# Altium project IMX8SoCIot.PrjPcb (part 6 of 9)

## Sheet USB_HUB.SchDoc
size 594 x 420 mm; SheetNumber: 14; SheetTotal: 20
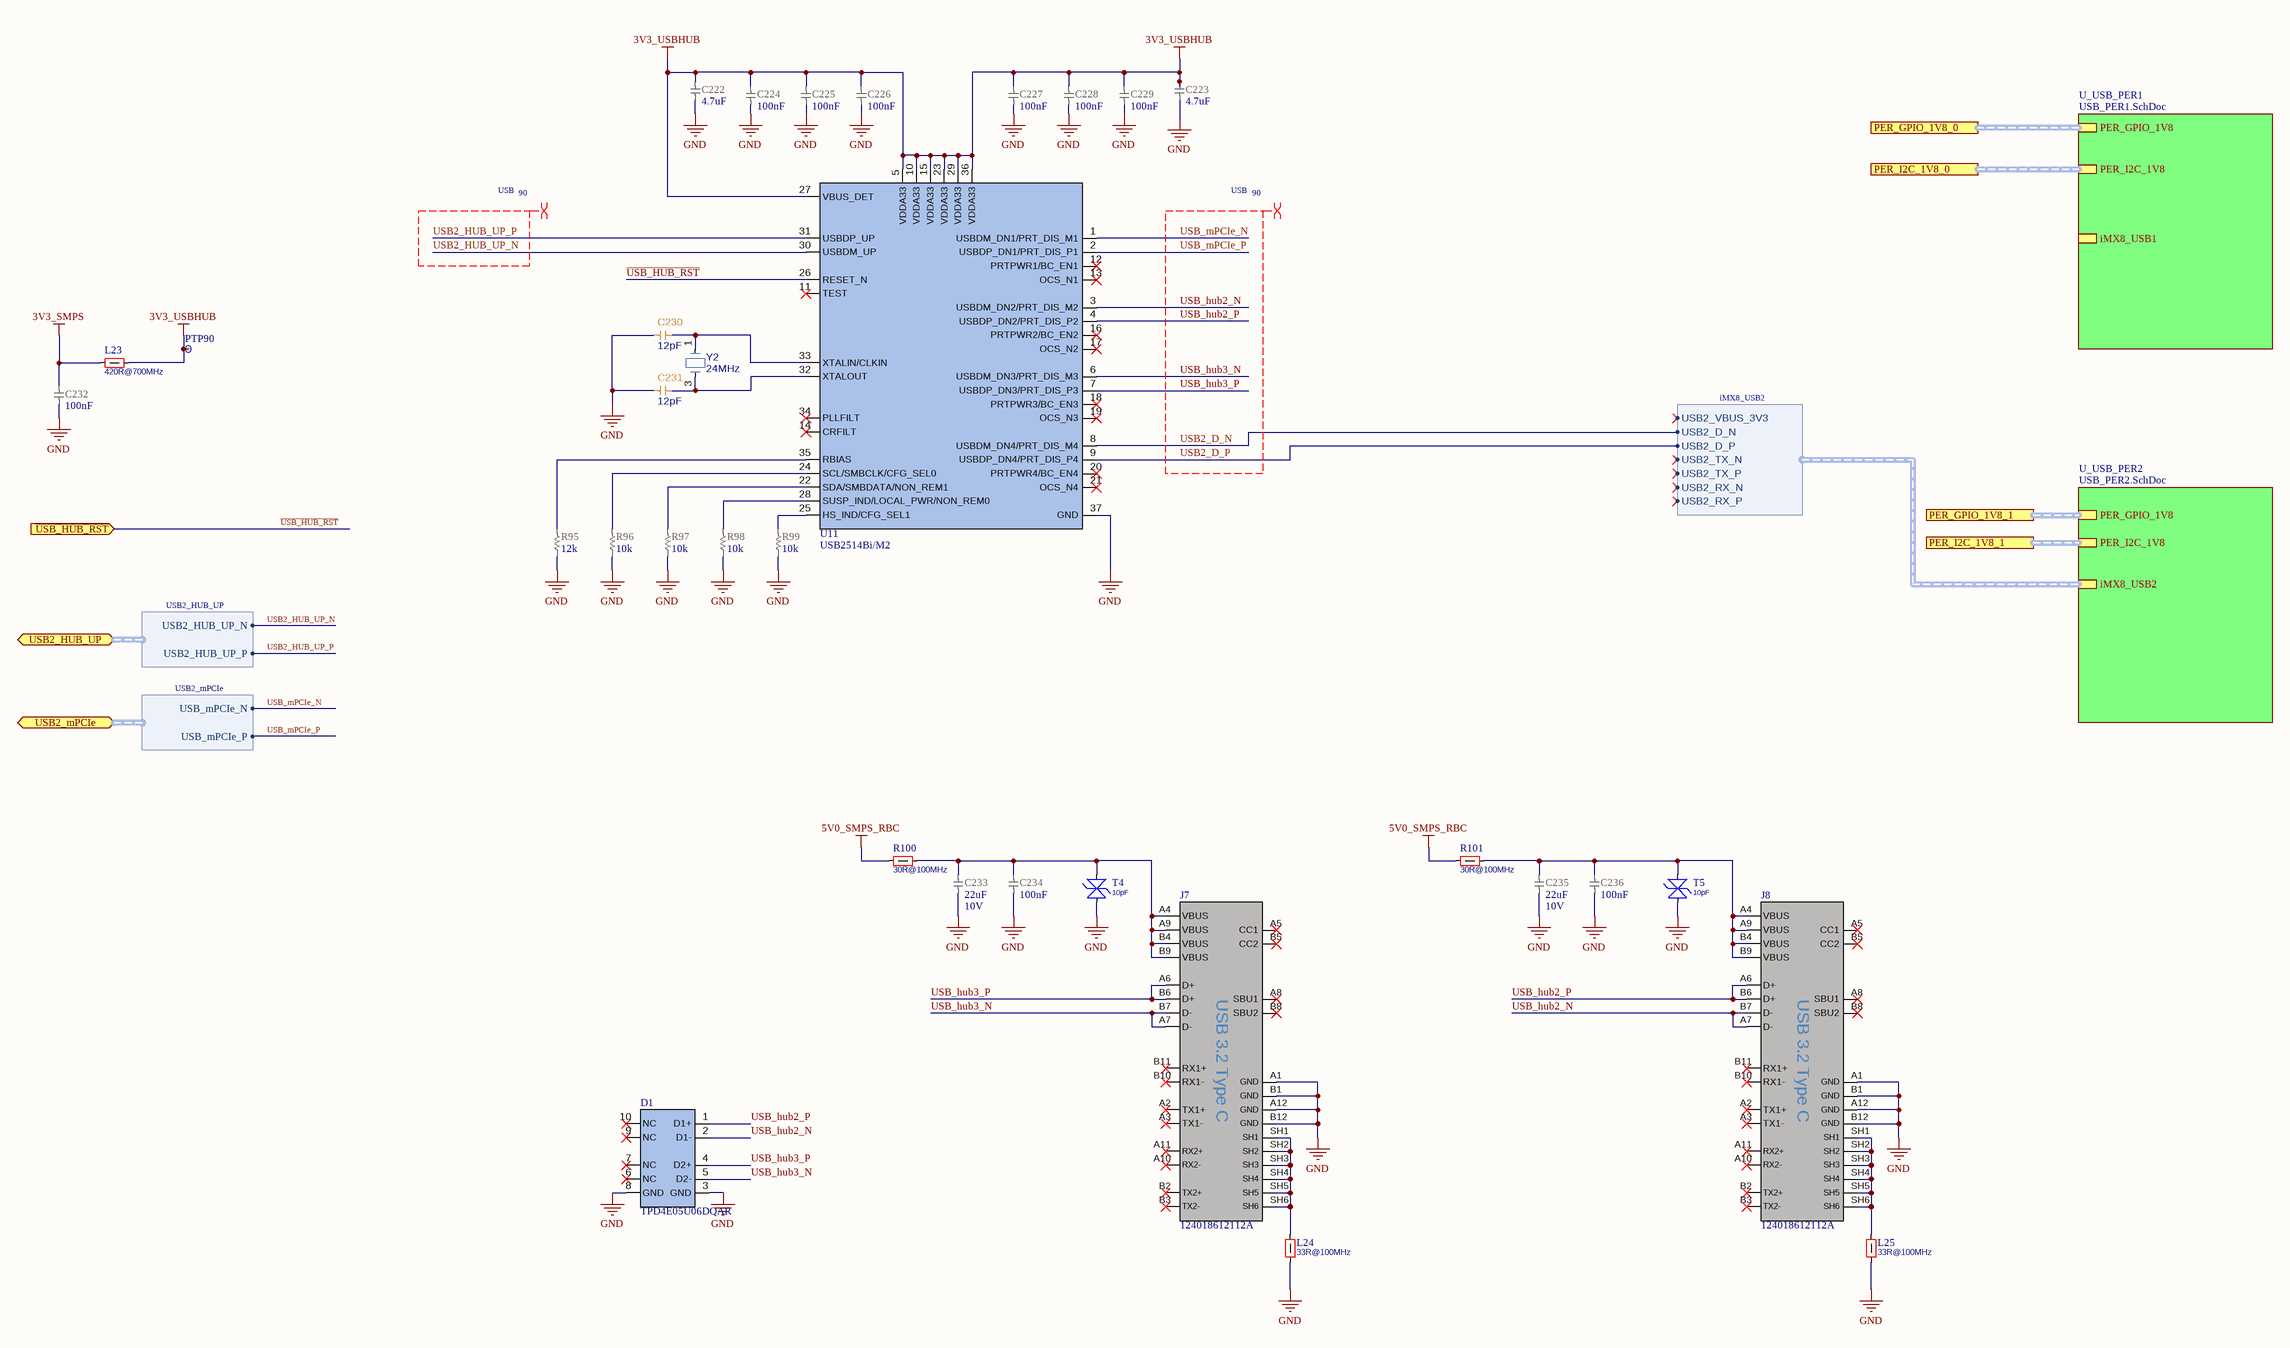
[diagram p25: USB_HUB.SchDoc]

### Parts
(Parts that share a designator on the sheet are numbered #1, #2 ... from top to bottom, then left to right.)
C222  value 4.7uF  [CAP_0402_H09W07_UN1Q]  (hidden comment: CAP_0402_4u7_10V_X6S)
C223  value 4.7uF  [CAP_0402_H09W07_UN1Q]  (hidden comment: CAP_0402_4u7_10V_X6S)
C224  value 100nF  [CAP_0201_UN1Q]  (hidden comment: CAP_0201_100n_X7S_16V)
C225  value 100nF  [CAP_0201_UN1Q]  (hidden comment: CAP_0201_100n_X7S_16V)
C226  value 100nF  [CAP_0201_UN1Q]  (hidden comment: CAP_0201_100n_X7S_16V)
C227  value 100nF  [CAP_0201_UN1Q]  (hidden comment: CAP_0201_100n_X7S_16V)
C228  value 100nF  [CAP_0201_UN1Q]  (hidden comment: CAP_0201_100n_X7S_16V)
C229  value 100nF  [CAP_0201_UN1Q]  (hidden comment: CAP_0201_100n_X7S_16V)
C230  value 12pF  [CAP_0201_UN1Q]  (hidden comment: CAP_0201_12pF_RF_MATCHING)
C231  value 12pF  [CAP_0201_UN1Q]  (hidden comment: CAP_0201_12pF_RF_MATCHING)
C232  value 100nF  [CAP_0201_UN1Q]  (hidden comment: CAP_0201_100n_X7S_16V)
C233  value 22uF  Voltage: 10V  [CAP_0805_UN1Q]  (hidden comment: CAP_0805_22uF_10V_X7R)
C234  value 100nF  [CAP_0201_UN1Q]  (hidden comment: CAP_0201_100n_X7S_16V)
C235  value 22uF  Voltage: 10V  [CAP_0805_UN1Q]  (hidden comment: CAP_0805_22uF_10V_X7R)
C236  value 100nF  [CAP_0201_UN1Q]  (hidden comment: CAP_0201_100n_X7S_16V)
D1  TPD4E05U06DQAR  [USON10_DQA_TI]
J7  Part Number: 124018612112A  [USB_C_AMPHENOL_124018612112A]  (hidden comment: USB_C_AMPHENOL_124018612112A)
J8  Part Number: 124018612112A  [USB_C_AMPHENOL_124018612112A]  (hidden comment: USB_C_AMPHENOL_124018612112A)
L23  value 420R@700MHz  [IND_0201_UN1Q]  (hidden comment: FERRITE_0201_BLF_700MHz_420Ohm)
L24  value 33R@100MHz  [IND_0201_UN1Q]  (hidden comment: FERRITE_0201_BLM03_33Ohm)
L25  value 33R@100MHz  [IND_0201_UN1Q]  (hidden comment: FERRITE_0201_BLM03_33Ohm)
PTP90  PTP_0.4mm  [PTP_0.4mm]  (value not drawn)  (no BOM)
R95  value 12k  [RES_0201_UN1Q]  (hidden comment: RES_0201_12k)
R96  value 10k  [RES_0201_UN1Q]  (hidden comment: RES_0201_10k)
R97  value 10k  [RES_0201_UN1Q]  (hidden comment: RES_0201_10k)
R98  value 10k  [RES_0201_UN1Q]  (hidden comment: RES_0201_10k)
R99  value 10k  [RES_0201_UN1Q]  (hidden comment: RES_0201_10k)
R100  value 30R@100MHz  [FERR_BLM15KD]  (hidden comment: FERRITE_0402_BLM15KD)
R101  value 30R@100MHz  [FERR_BLM15KD]  (hidden comment: FERRITE_0402_BLM15KD)
T4  value 10pF  [TVS_0201_EZAEG]  (hidden comment: TVS_0201_10pF)
T5  value 10pF  [TVS_0201_EZAEG]  (hidden comment: TVS_0201_10pF)
U11#2  Part Number: USB2514Bi/M2  [USB251xB_QFN36P50_600X600X100]  (hidden comment: USB2514Bi_M2)
Y2  value 24MHz  [XTAL_3225_EPSON]  (hidden comment: XTAL_24M_10ppm_9pF_+105C)

### Sub-sheets
U_USB_PER1 = USB_PER1.SchDoc: PER_GPIO_1V8 (harness PER_GPIO_1V8_0), iMX8_USB1 (harness iMX8_USB1), PER_I2C_1V8 (harness PER_I2C_1V8_0)
U_USB_PER2 = USB_PER2.SchDoc: PER_GPIO_1V8 (harness PER_GPIO_1V8_1), PER_I2C_1V8 (harness PER_I2C_1V8_1), iMX8_USB2 (harness iMX8_USB2)

### Ports
PER_GPIO_1V8_0 (harness PER_GPIO_1V8_0), PER_GPIO_1V8_1 (harness PER_GPIO_1V8_1), PER_I2C_1V8_0 (harness PER_GPIO_1V8_0), PER_I2C_1V8_1 (harness PER_GPIO_1V8_1), USB2_HUB_UP (bidir, harness USB2_HUB_UP), USB2_mPCIe (bidir, harness USB2_mPCIe), ~{USB_HUB_RST} (in)

### Harnesses
USB2_HUB_UP: USB2_HUB_UP_P, USB2_HUB_UP_N
USB2_mPCIe: USB_mPCIe_N, USB_mPCIe_P
iMX8_USB2: USB2_VBUS_3V3, USB2_D_N, USB2_D_P, USB2_TX_N, USB2_TX_P, USB2_RX_N, USB2_RX_P

### Nets
3V3_SMPS: C232.2 L23.1
3V3_USBHUB: C222.2 C223.2 C224.1 C225.1 C226.1 C227.1 C228.1 C229.1 L23.2 PTP90.1(TP) U11#2.5(VDDA33) U11#2.10(VDDA33) U11#2.15(VDDA33) U11#2.23(VDDA33) U11#2.27(VBUS_DET) U11#2.29(VDDA33) U11#2.36(VDDA33)
5V0_SMPS_RBC: R100.1 R101.1
GND: C222.1 C223.1 C224.2 C225.2 C226.2 C227.2 C228.2 C229.2 C230.1 C231.1 C232.1 C233.1 C234.1 C235.1 C236.1 D1.3(GND) D1.8(GND) J7.A1(GND) J7.A12(GND) J7.B1(GND) J7.B12(GND) J8.A1(GND) J8.A12(GND) J8.B1(GND) J8.B12(GND) L24.2 L25.2 R95.1 R96.1 R97.1 R98.1 R99.1 T4.1 T5.1 U11#2.37(GND) Y2.2(GND) Y2.4(GND)
~{USB_HUB_RST}: U11#2.26(RESET_N) ; port ~{USB_HUB_RST}
USB2_D_N: U11#2.8(USBDM_DN4/PRT_DIS_M4) ; sheet U_USB_PER2/iMX8_USB2.USB2_D_N
USB2_D_P: U11#2.9(USBDP_DN4/PRT_DIS_P4) ; sheet U_USB_PER2/iMX8_USB2.USB2_D_P
USB2_HUB_UP_N: U11#2.30(USBDM_UP) ; port USB2_HUB_UP.USB2_HUB_UP_N
USB2_HUB_UP_P: U11#2.31(USBDP_UP) ; port USB2_HUB_UP.USB2_HUB_UP_P
USB_hub2_N: D1.2(D1-) J8.A7(D-) J8.B7(D-) U11#2.3(USBDM_DN2/PRT_DIS_M2)
USB_hub2_P: D1.1(D1+) J8.A6(D+) J8.B6(D+) U11#2.4(USBDP_DN2/PRT_DIS_P2)
USB_hub3_N: D1.5(D2-) J7.A7(D-) J7.B7(D-) U11#2.6(USBDM_DN3/PRT_DIS_M3)
USB_hub3_P: D1.4(D2+) J7.A6(D+) J7.B6(D+) U11#2.7(USBDP_DN3/PRT_DIS_P3)
USB_mPCIe_N: U11#2.1(USBDM_DN1/PRT_DIS_M1) ; port USB2_mPCIe.USB_mPCIe_N
USB_mPCIe_P: U11#2.2(USBDP_DN1/PRT_DIS_P1) ; port USB2_mPCIe.USB_mPCIe_P
NetC230_2: C230.2 U11#2.33(XTALIN/CLKIN) Y2.1
NetC231_2: C231.2 U11#2.32(XTALOUT) Y2.3
NetC233_2: C233.2 C234.2 J7.A4(VBUS) J7.A9(VBUS) J7.B4(VBUS) J7.B9(VBUS) R100.2 T4.2
NetC235_2: C235.2 C236.2 J8.A4(VBUS) J8.A9(VBUS) J8.B4(VBUS) J8.B9(VBUS) R101.2 T5.2
NetJ7_SH1: J7.SH1 J7.SH2 J7.SH3 J7.SH4 J7.SH5 J7.SH6 L24.1
NetJ8_SH1: J8.SH1 J8.SH2 J8.SH3 J8.SH4 J8.SH5 J8.SH6 L25.1
NetR95_2: R95.2 U11#2.35(RBIAS)
NetR96_2: R96.2 U11#2.24(SCL/SMBCLK/CFG_SEL0)
NetR97_2: R97.2 U11#2.22(SDA/SMBDATA/NON_REM1)
NetR98_2: R98.2 U11#2.28(SUSP_IND/LOCAL_PWR/NON_REM0)
NetR99_2: R99.2 U11#2.25(HS_IND/CFG_SEL1)

Not connected (* = marked no-connect by the designer): D1 6(NC)* 7(NC)* 9(NC)* 10(NC)*; J7 A2(TX1+)* A3(TX1-)* A5(CC1)* A8(SBU1)* A10(RX2-)* A11(RX2+)* B2(TX2+)* B3(TX2-)* B5(CC2)* B8(SBU2)* B10(RX1-)* B11(RX1+)*; J8 A2(TX1+)* A3(TX1-)* A5(CC1)* A8(SBU1)* A10(RX2-)* A11(RX2+)* B2(TX2+)* B3(TX2-)* B5(CC2)* B8(SBU2)* B10(RX1-)* B11(RX1+)*; U11#2 11(TEST)* 12(PRTPWR1/BC_EN1)* 13(OCS_N1)* 14(CRFILT)* 16(PRTPWR2/BC_EN2)* 17(OCS_N2)* 18(PRTPWR3/BC_EN3)* 19(OCS_N3)* 20(PRTPWR4/BC_EN4)* 21(OCS_N4)* 34(PLLFILT)*

### Buses and harness runs
harness port PER_GPIO_1V8_0 = sheet U_USB_PER1/PER_GPIO_1V8
harness port PER_GPIO_1V8_1 = sheet U_USB_PER2/PER_GPIO_1V8
harness port PER_I2C_1V8_0 = sheet U_USB_PER1/PER_I2C_1V8
harness port PER_I2C_1V8_1 = sheet U_USB_PER2/PER_I2C_1V8

### Layout directives
differential pair; differential pair class 90; net class USB; rule Matched Net Lengths [Tolerance = 0.3mm]: USB2_D_N, USB2_D_P, USB2_HUB_UP_N, USB2_HUB_UP_P, USB_hub2_N, USB_hub2_P, USB_hub3_N, USB_hub3_P, USB_mPCIe_N, USB_mPCIe_P

### Notes on the sheet
- DWG NO:
- REV:
- THIS DOCUMENT AND THE DATA DISCLOSED HEREIN OR
- HEREWITH IS THE PROPERTY OF ALTIUM LIMITED AND MAY
- BE FREELY DISTRIBUTED IN WHOLE. NO RIGHTS ARE
- RESERVED OR EXPRESS OR IMPLIED WARANTEE GIVEN.
- REVISION
- DESCRIPTION
- DATE
- APPROVED
- ENG:
- APPROVALS
- PROJECT
- DSN:
- CHK:
- REFERENCE DOCUMENTS
- PROJECT REVISION:
- TITLE
- DOCUMENT REVISION:
- DESIGN ITEM:
- BOM:
- FAB DWG:
- PCB DWG:
- ASSY DWG:
- SCALE:
- A2
- SIZE
- CAGE CODE
- FILE NAME
- DWG NO.
- SHEET
- OF
- REV
- (in symbol CMP-001-001438-8) USB 3.2 Type C

### Library data of the parts
C222 C223 = CMP-001-000888-12: as C121 on sheet IMX8_PMIC; ComponentLink2Description: 2_Product page; Package: 0402; Creation date: 26042024; ComponentLink1Description: 1_Datasheet; ComponentLink3Description: 3_X-information; ComponentLink4Description: 4_X-information; Manufacturer Part Number: GRT155C81A475ME13J; Component Type: Capacitor
C224-C229 C232 C234 C236 = CMP-001-000385-16: CAP; Part Number: GRM033C71C104KE14D; Manufacturer: Murata; Temperature characteristics: X7S; Tolerance: +/-10%; Sort order: 302; HasBeenBuilt: TBD; Alternative component: Allowed; Voltage: 16V; System: RLC; Package: 0201; ClassName: SMALL; ComponentLink1Description: 1_Datasheet; ComponentLink2Description: 2_Product page; ComponentLink3Description: 3_X-information; ComponentLink4Description: 4_X-information; Creation date: 20190101; Source: RLC_UN1Q.SchLib; Manufacturer Part Number: GRM033C71C104KE14D; Component Type: Capacitor
C230 C231 = CMP-001-000420-11: as C139 on sheet IMX8_PMIC; Package: 0201; Operating temperature range: -55 ... +125C; ComponentLink1Description: 1_Datasheet; ComponentLink2Description: 2_Product page; ComponentLink3Description: 3_X-information; ComponentLink4Description: 4_X-information; Creation date: 20211123; ClassName: SMALL; Source: RLC_UN1Q.SchLib; Manufacturer Part Number: GRM0335C1H120GA01; Component Type: Capacitor
C233 C235 = CMP-001-000892-11: CAP; Part Number: GRM21BZ71A226ME15L; Manufacturer: Murata; Tolerance: +/-20%; Alternative component: Allowed; Sort order: 308; Temperature characteristics: X7R; System: RLC; HasBeenBuilt: TBD; Creation date: 22032024; ComponentLink4Description: 4_X-information; ComponentLink1Description: 1_Datasheet; ComponentLink3Description: 3_X-information; ComponentLink2Description: 2_Product page; Package: 0805; Manufacturer Part Number: GRM21BZ71A226ME15L; Component Type: Capacitor
D1 = CMP-001-000916-4: 4-CH Low-Capacitance ESD Diode; Manufacturer: Texas Instruments; HasBeenBuilt: Saluki3_HW_RIB_2; Sort order: 405; System: IC; ComponentLink1Description: 1_Datasheet; ComponentLink1URL: http://www.ti.com/lit/gpn/tpd4e05u06; ComponentLink2Description: 2_Product page; ComponentLink2URL: https://www.ti.com/product/TPD4E05U06; ComponentLink3Description: 3_X-information; ComponentLink4Description: 4_X-information; Creation date: 20210927; Dimensions WxLxH: 2.5x1.0x0.55; Operating temperature range: -40... +125 °C; Package: USON10; Part Number: TPD4E05U06DQAR; ECCN: EAR99; RoHS: RoHS3; Source: UUDET_KOMPONENTIT.SchLib; Manufacturer Part Number: TPD4E05U06DQAR; Component Type: ESD & EMI
J7 J8 = CMP-001-001438-8: USB3.2 GEN1, Type C, Top mount, CH 1.50mm, Dual Row SMT, IPX8; Manufacturer Part Number: 12402082E512A; Sort order: 101; System: Connector; ClassName: BIG; ComponentLink1Description: 1_Datasheet; ComponentLink1URL: https://cdn.amphenol-cs.com/media/wysiwyg/files/documentation/datasheet/inputoutput/io_usb_type_c.pdf; ComponentLink2Description: 2_Product page; ComponentLink2URL: https://www.amphenol-cs.com/product/124018612112a.html; ComponentLink3Description: 3_X-information; ComponentLink4Description: 4_X-information; Operating temperature range: -40C to +85C; Creation date: 20250617; Manufacturer: Amphenol; ECCN: EAR99; Design Item ID: USB_C_AMPHENOL_124018612112A; RoHS: RoHS 3; Component Type: Interface Connector
L23 = CMP-001-000747-7: FERRITE; Part Number: BLF03JD421GZE; Manufacturer: Murata; HasBeenBuilt: False; System: Discrete; Sort order: 362; Tolerance: 25%; ComponentLink3Description: 3_X-information; Creation date: 20200304; ClassName: SMALL; ComponentLink1Description: 1_Datasheet; ComponentLink2Description: 2_Product page; Package: 0201; ComponentLink4Description: 4_X-information; Source: Discrete_UN1Q.SchLib; Operating temperature range: -55 ... +125C; Manufacturer Part Number: BLF03JD421GZE; Component Type: Ferrite
L24 L25 = CMP-001-000744-7: FERRITE; Manufacturer: Murata; Part Number: BLM03PG330SN1; Tolerance: 25%; Sort order: 362; HasBeenBuilt: TBD; System: Discrete; Package: 0201; Operating temperature range: -55 ... +125C; ClassName: SMALL; ComponentLink1Description: 1_Datasheet; ComponentLink1URL: https://www.murata.com/en-us/products/productdetail.aspx?cate=luNoiseSupprFilteChipFerriBead&partno=BLM03PG330SN1%23; ComponentLink2Description: 2_Product page; ComponentLink3Description: 3_X-information; ComponentLink4Description: 4_X-information; Creation date: 20200304; Source: Discrete_UN1Q.SchLib; Manufacturer Part Number: BLM03PG330SN1; Component Type: Ferrite
PTP90 = CMP-001-001296-3: as PTP12 on sheet IMX8_PHY; ComponentLink4Description: 4_X-information; ComponentLink1Description: 1_Datasheet; Part Number: PTP 0.4mm; Sort order: -; ClassName: SMALL; System: Test Point; HasBeenBuilt: -; Design Item ID: PTP_0.4mm; ComponentLink3Description: 3_X-information; Creation date: 20240909; ComponentLink2Description: 2_Product page
R95 = CMP-001-000450-13: RES; Part Number: RC0201FR-0712KL; Manufacturer: YAGEO; Power Rating: 1/20W; Alternative component: Allowed; Tolerance: 1%; System: RLC; Sort order: 322; HasBeenBuilt: TBD; Package: 0201; ComponentLink4Description: 4_X-information; ComponentLink1Description: 1_Datasheet; Creation date: 20190101; Source: RLC_UN1Q.SchLib; ComponentLink2Description: 2_Product page; ClassName: SMALL; ComponentLink3Description: 3_X-information; Component Type: Resistor
R96-R99 = CMP-001-000446-13: RES; Part Number: RC0201FR-0710KL; Manufacturer: YAGEO; Power Rating: 1/20W; Sort order: 322; HasBeenBuilt: TBD; Tolerance: 1%; Alternative component: Allowed; System: RLC; Package: 0201; ClassName: SMALL; ComponentLink1Description: 1_Datasheet; ComponentLink2Description: 2_Product page; ComponentLink3Description: 3_X-information; ComponentLink4Description: 4_X-information; Creation date: 20190101; Source: RLC_UN1Q.SchLib; Component Type: Resistor
R100 R101 = CMP-001-000738-12: FERRITE; Part Number: BLM15KD300SN1; Manufacturer: Murata; Manufacturer Part Number: BLM15KD300SN1D; Sort order: 364; HasBeenBuilt: Saluki2; System: Discrete; Current: 3.1A; Package: 0402; Operating temperature range: -55 ... +125C; Dimensions WxLxH: 0.55mm; ComponentLink1Description: 1_Datasheet; ComponentLink1URL: https://www.murata.com/en-us/products/productdetail.aspx?cate=luNoiseSupprFilteChipFerriBead&partno=BLM15KD300SN1%23; ComponentLink2Description: 2_Product page; ComponentLink3Description: 3_X-information; ComponentLink4Description: 4_X-information; Creation date: 20200304; Source: Discrete_UN1Q.SchLib; ECCN: EAR99; RoHS: RoHS3; Component Type: Ferrite
T4 T5 = CMP-001-000756-6: ESD Protection  TVS Diodes SMP Diode 0201 5vdc 10 pf <8v clamp@1a; Part Number: GG020105100N2P; Manufacturer: TDK; Voltage: 5.5V; Sort order: 402; HasBeenBuilt: TBD; System: Discrete; Package: 0201; Operating temperature range: -40 ... +85C; Dimensions WxLxH: tbd; ComponentLink1Description: 1_Datasheet; ComponentLink1URL: https://www2.mouser.com/datasheet/2/40/AVX_GiGuard-1101674.pdf; ComponentLink2Description: 2_Product page; ComponentLink3Description: 3_X-information; ComponentLink4Description: 4_X-information; Creation date: 20211207; ClassName: SMALL; Source: Discrete_UN1Q.SchLib; Manufacturer Part Number: GG020105100N2P; Component Type: ESD & EMI
U11#2 = CMP-076-000057-8: USB 2.0 Hi-Speed Hub Controller; Manufacturer: Microchip; HasBeenBuilt: SleeveIO_01; Sort order: 501; System: IC; ClassName: BIG; ComponentLink1Description: 1_Datasheet; ComponentLink1URL: http://www.microchip.com/mymicrochip/filehandler.aspx?ddocname=en562310; ComponentLink2Description: 2_Product page; ComponentLink2URL: https://www.microchip.com/en-us/product/USB2513B; Creation Date: 20211026; Dimensions WxLxH: 6x6x1; Operating temperature range: -40 ... +85 °C; Package: SQFN36; Source: IC_UN1Q.SchLib; Design Item ID: USB2514Bi_M2; ComponentLink3Description: 3_X-information; ComponentLink4Description: 4_X-information; Manufacturer Part Number: USB2514Bi/M2; Component Type: Data Converter
Y2 = CMP-001-001243-5: Crystal 24 MHz ±10ppm 9pF 40Ohms 4-SMD; Part Number: TSX-3225 24.0000MF20G-AC3; Manufacturer: EPSON; Tolerance: +/-10ppm; Sort order: 455; System: Discrete; Operating temperature range: -40 ... +105C; Dimensions WxLxH: 3.2 x 2.5 x 0.6mm; ComponentLink1Description: 1_Datasheet; ComponentLink1URL: https://support.epson.biz/td/api/doc_check.php?dl=brief_TSX-3225&lang=en; ComponentLink2Description: 2_Product page; ComponentLink3Description: 3_X-information; ComponentLink4Description: 4_X-information; Creation date: 20240430; Manufacturer: Epson; Manufacturer Part Number: TSX-3225 24.0000MF20G-AC3; Component Type: Crystal & Oscillator

## Sheet USB_PER1.SchDoc
size 594 x 420 mm; SheetNumber: 15; SheetTotal: 20
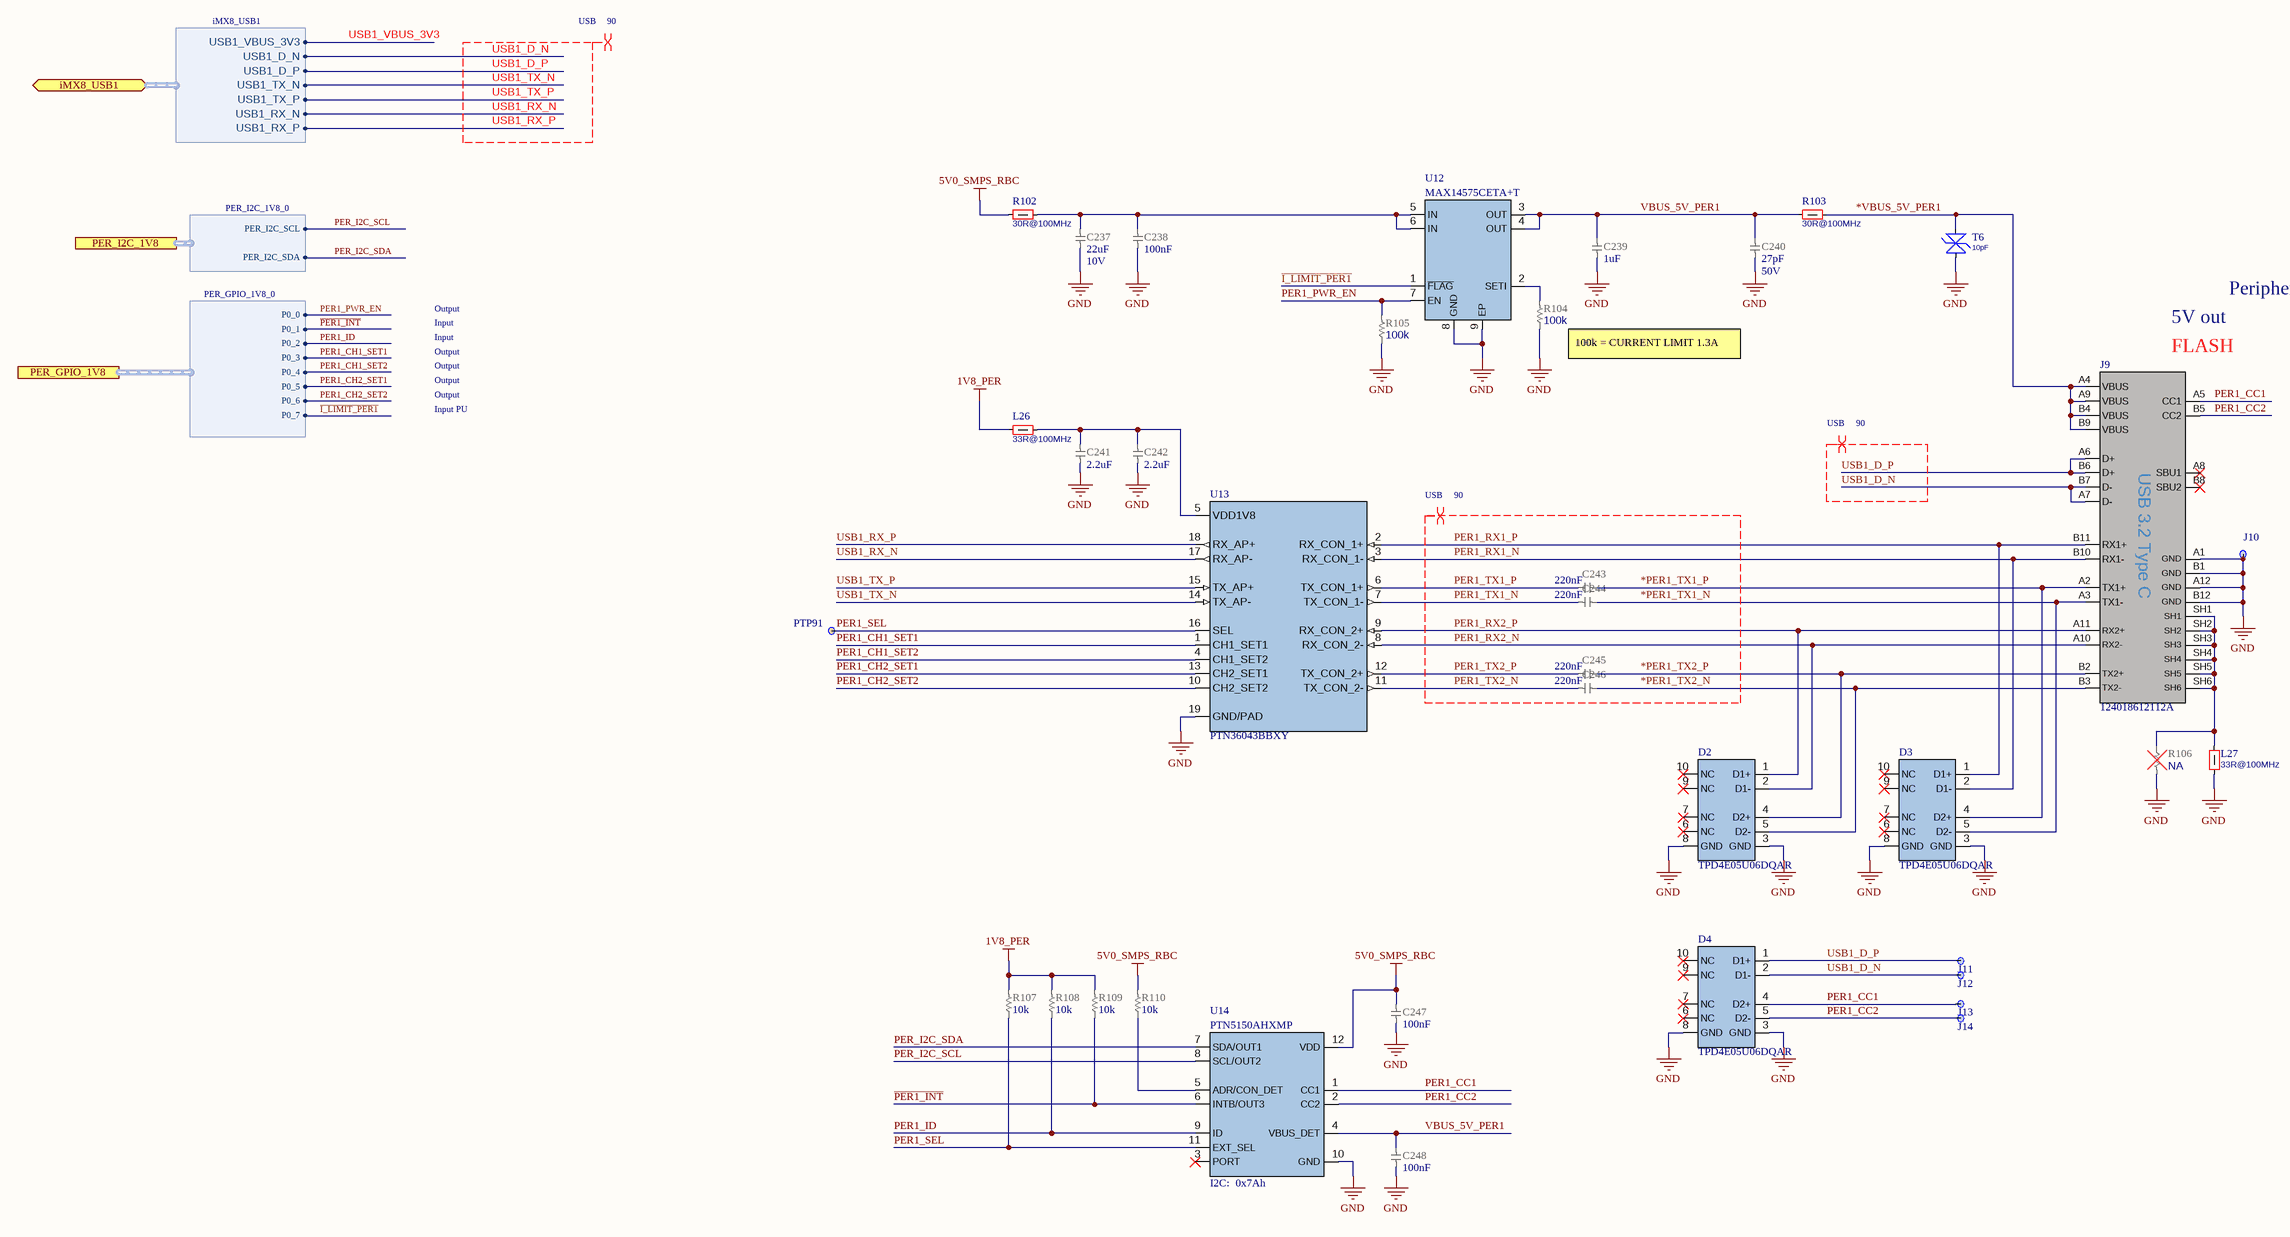
[diagram p26: USB_PER1.SchDoc]

### Parts
C237  value 22uF  Voltage: 10V  [CAP_0805_UN1Q]  (hidden comment: CAP_0805_22uF_10V_X7R)
C238  value 100nF  [CAP_0201_UN1Q]  (hidden comment: CAP_0201_100n_X7S_16V)
C239  value 1uF  [CAP_0201_UN1Q]  (hidden comment: CAP_0201_1uF_X6S)
C240  value 27pF  Voltage: 50V  [CAP_0201_UN1Q]  (hidden comment: CAP_0201_27p)
C241  value 2.2uF  [CAP_0402_H09W07_UN1Q]  (hidden comment: CAP_0402_2u2_10V_X6S)
C242  value 2.2uF  [CAP_0402_H09W07_UN1Q]  (hidden comment: CAP_0402_2u2_10V_X6S)
C243  value 220nF  [CAP_0201_UN1Q]  (hidden comment: CAP_0201_220n_10V_X6S)
C244  value 220nF  [CAP_0201_UN1Q]  (hidden comment: CAP_0201_220n_10V_X6S)
C245  value 220nF  [CAP_0201_UN1Q]  (hidden comment: CAP_0201_220n_10V_X6S)
C246  value 220nF  [CAP_0201_UN1Q]  (hidden comment: CAP_0201_220n_10V_X6S)
C247  value 100nF  [CAP_0201_UN1Q]  (hidden comment: CAP_0201_100n_X7S_16V)
C248  value 100nF  [CAP_0201_UN1Q]  (hidden comment: CAP_0201_100n_X7S_16V)
D2  TPD4E05U06DQAR  [USON10_DQA_TI]
D3  TPD4E05U06DQAR  [USON10_DQA_TI]
D4  TPD4E05U06DQAR  [USON10_DQA_TI]
J9  Part Number: 124018612112A  [USB_C_AMPHENOL_124018612112A]  (hidden comment: USB_C_AMPHENOL_124018612112A)
J10  Testpoint, Surface, 1.0mm  [TP_1mm_UN1Q]  (value not drawn)  (no BOM)
J11  Testpoint, Surface, 1.0mm  [TP_1mm_UN1Q]  (value not drawn)  (no BOM)
J12  Testpoint, Surface, 1.0mm  [TP_1mm_UN1Q]  (value not drawn)  (no BOM)
J13  Testpoint, Surface, 1.0mm  [TP_1mm_UN1Q]  (value not drawn)  (no BOM)
J14  Testpoint, Surface, 1.0mm  [TP_1mm_UN1Q]  (value not drawn)  (no BOM)
L26  value 33R@100MHz  [IND_0201_UN1Q]  (hidden comment: FERRITE_0201_BLM03_33Ohm)
L27  value 33R@100MHz  [IND_0201_UN1Q]  (hidden comment: FERRITE_0201_BLM03_33Ohm)
PTP91  PTP_0.4mm  [PTP_0.4mm]  (value not drawn)  (no BOM)
R102  value 30R@100MHz  [FERR_BLM15KD]  (hidden comment: FERRITE_0402_BLM15KD)
R103  value 30R@100MHz  [FERR_BLM15KD]  (hidden comment: FERRITE_0402_BLM15KD)
R104  value 100k  [RES_0201_UN1Q]  (hidden comment: RES_0201_100k)
R105  value 100k  [RES_0201_UN1Q]  (hidden comment: RES_0201_100k)
R106  value NA  [RES_0201_UN1Q]  (hidden comment: RES_0201_NA)
R107  value 10k  [RES_0201_UN1Q]  (hidden comment: RES_0201_10k)
R108  value 10k  [RES_0201_UN1Q]  (hidden comment: RES_0201_10k)
R109  value 10k  [RES_0201_UN1Q]  (hidden comment: RES_0201_10k)
R110  value 10k  [RES_0201_UN1Q]  (hidden comment: RES_0201_10k)
T6  value 10pF  [TVS_0201_EZAEG]  (hidden comment: TVS_0201_10pF)
U12  Part Number: MAX14575CETA+T  [TDFN8-MAX14575C]  (hidden comment: MAX14575C)
U13  PTN36043BBXY  [DHX2QFN18_NXP]
U14  PTN5150AHXMP  [X2QFN12_NXP]

### Ports
iMX8_USB1 (bidir, harness iMX8_USB1), PER_GPIO_1V8 (harness PER_GPIO_1V8_0), PER_I2C_1V8 (harness PER_I2C_1V8_0)

### Harnesses
PER_I2C_1V8_0: PER_I2C_SCL, PER_I2C_SDA
PER_GPIO_1V8_0: P0_0, P0_1, P0_2, P0_3, P0_4, P0_5, P0_6, P0_7
iMX8_USB1: USB1_VBUS_3V3, USB1_D_N, USB1_D_P, USB1_TX_N, USB1_TX_P, USB1_RX_N, USB1_RX_P

### Nets
1V8_PER: L26.1 R107.2 R108.2 R109.2
5V0_SMPS_RBC: C247.1 R102.1 R110.2 U14.12(VDD)
GND: C237.1 C238.1 C239.1 C240.1 C241.2 C242.2 C247.2 C248.2 D2.3(GND) D2.8(GND) D3.3(GND) D3.8(GND) D4.3(GND) D4.8(GND) J9.A1(GND) J9.A12(GND) J9.B1(GND) J9.B12(GND) J10.1(TP) L27.2 R104.1 R105.1 R106.2 T6.1 U12.8(GND) U12.9(EP) U13.19(GND/PAD) U14.10(GND)
*PER1_TX1_N: C244.1 D3.5(D2-) J9.A3(TX1-)
*PER1_TX1_P: C243.1 D3.4(D2+) J9.A2(TX1+)
*PER1_TX2_N: C246.1 D2.5(D2-) J9.B3(TX2-)
*PER1_TX2_P: C245.1 D2.4(D2+) J9.B2(TX2+)
*VBUS_5V_PER1: J9.A4(VBUS) J9.A9(VBUS) J9.B4(VBUS) J9.B9(VBUS) R103.2 T6.2
~{I_LIMIT_PER1}: U12.1(~{FLAG}) ; port PER_GPIO_1V8.P0_7
~{PER1_INT}: R109.1 U14.6(INTB/OUT3) ; port PER_GPIO_1V8.P0_1
PER1_CC1: D4.4(D2+) J9.A5(CC1) J13.1(TP) U14.1(CC1)
PER1_CC2: D4.5(D2-) J9.B5(CC2) J14.1(TP) U14.2(CC2)
PER1_CH1_SET1: U13.1(CH1_SET1) ; port PER_GPIO_1V8.P0_3
PER1_CH1_SET2: U13.4(CH1_SET2) ; port PER_GPIO_1V8.P0_4
PER1_CH2_SET1: U13.13(CH2_SET1) ; port PER_GPIO_1V8.P0_5
PER1_CH2_SET2: U13.10(CH2_SET2) ; port PER_GPIO_1V8.P0_6
PER1_ID: R108.1 U14.9(ID) ; port PER_GPIO_1V8.P0_2
PER1_PWR_EN: R105.2 U12.7(EN) ; port PER_GPIO_1V8.P0_0
PER1_RX1_N: D3.2(D1-) J9.B10(RX1-) U13.3(RX_CON_1-)
PER1_RX1_P: D3.1(D1+) J9.B11(RX1+) U13.2(RX_CON_1+)
PER1_RX2_N: D2.2(D1-) J9.A10(RX2-) U13.8(RX_CON_2-)
PER1_RX2_P: D2.1(D1+) J9.A11(RX2+) U13.9(RX_CON_2+)
PER1_SEL: PTP91.1(TP) R107.1 U13.16(SEL) U14.11(EXT_SEL)
PER1_TX1_N: C244.2 U13.7(TX_CON_1-)
PER1_TX1_P: C243.2 U13.6(TX_CON_1+)
PER1_TX2_N: C246.2 U13.11(TX_CON_2-)
PER1_TX2_P: C245.2 U13.12(TX_CON_2+)
PER_I2C_SCL: U14.8(SCL/OUT2) ; port PER_I2C_1V8.PER_I2C_SCL
PER_I2C_SDA: U14.7(SDA/OUT1) ; port PER_I2C_1V8.PER_I2C_SDA
USB1_D_N: D4.2(D1-) J9.A7(D-) J9.B7(D-) J12.1(TP) ; port iMX8_USB1.USB1_D_N
USB1_D_P: D4.1(D1+) J9.A6(D+) J9.B6(D+) J11.1(TP) ; port iMX8_USB1.USB1_D_P
USB1_RX_N: U13.17(RX_AP-) ; port iMX8_USB1.USB1_RX_N
USB1_RX_P: U13.18(RX_AP+) ; port iMX8_USB1.USB1_RX_P
USB1_TX_N: U13.14(TX_AP-) ; port iMX8_USB1.USB1_TX_N
USB1_TX_P: U13.15(TX_AP+) ; port iMX8_USB1.USB1_TX_P
VBUS_5V_PER1: C239.2 C240.2 C248.1 R103.1 U12.3(OUT) U12.4(OUT) U14.4(VBUS_DET)
NetC237_2: C237.2 C238.2 R102.2 U12.5(IN) U12.6(IN)
NetC241_1: C241.1 C242.1 L26.2 U13.5(VDD1V8)
NetJ9_SH1: J9.SH1 J9.SH2 J9.SH3 J9.SH4 J9.SH5 J9.SH6 L27.1 R106.1
NetR104_2: R104.2 U12.2(SETI)
NetR110_1: R110.1 U14.5(ADR/CON_DET)

Not connected (* = marked no-connect by the designer): D2 6(NC)* 7(NC)* 9(NC)* 10(NC)*; D3 6(NC)* 7(NC)* 9(NC)* 10(NC)*; D4 6(NC)* 7(NC)* 9(NC)* 10(NC)*; J9 A8(SBU1)* B8(SBU2)*; U14 3(PORT)*

### Layout directives
differential pair; differential pair class 90; net class USB; rule Matched Net Lengths [Tolerance = 0.3mm]: *PER1_TX1_N, *PER1_TX1_P, *PER1_TX2_N, *PER1_TX2_P, PER1_RX1_N, PER1_RX1_P, PER1_RX2_N, PER1_RX2_P, PER1_TX1_N, PER1_TX1_P, PER1_TX2_N, PER1_TX2_P, USB1_D_N, USB1_D_P, USB1_RX_N, USB1_RX_P, USB1_TX_N, USB1_TX_P

### Notes on the sheet
- Output
- Peripheral Connector 1
- Input
- (near R104) 100k = CURRENT LIMIT 1.3A
- 5V out
- (near J9) FLASH
- Input PU
- (near U14) I2C:  0x7Ah
- DWG NO:
- REV:
- THIS DOCUMENT AND THE DATA DISCLOSED HEREIN OR
- HEREWITH IS THE PROPERTY OF ALTIUM LIMITED AND MAY
- BE FREELY DISTRIBUTED IN WHOLE. NO RIGHTS ARE
- RESERVED OR EXPRESS OR IMPLIED WARANTEE GIVEN.
- REVISION
- DESCRIPTION
- DATE
- APPROVED
- ENG:
- APPROVALS
- PROJECT
- DSN:
- CHK:
- REFERENCE DOCUMENTS
- PROJECT REVISION:
- TITLE
- DOCUMENT REVISION:
- DESIGN ITEM:
- BOM:
- FAB DWG:
- PCB DWG:
- ASSY DWG:
- SCALE:
- A2
- SIZE
- CAGE CODE
- FILE NAME
- DWG NO.
- SHEET
- OF
- REV
- (in symbol CMP-001-001438-8) USB 3.2 Type C

### Library data of the parts
C237 = CMP-001-000892-11: as C233 on sheet USB_HUB; Creation date: 22032024; ComponentLink4Description: 4_X-information; ComponentLink1Description: 1_Datasheet; ComponentLink3Description: 3_X-information; ComponentLink2Description: 2_Product page; Package: 0805; Manufacturer Part Number: GRM21BZ71A226ME15L; Component Type: Capacitor
C238 C247 C248 = CMP-001-000385-16: as C224-C229 on sheet USB_HUB; Package: 0201; ClassName: SMALL; ComponentLink1Description: 1_Datasheet; ComponentLink2Description: 2_Product page; ComponentLink3Description: 3_X-information; ComponentLink4Description: 4_X-information; Creation date: 20190101; Source: RLC_UN1Q.SchLib; Manufacturer Part Number: GRM033C71C104KE14D; Component Type: Capacitor
C239 = CMP-001-000336-15: CAP; Part Number: KGM03CS61A105MH; Manufacturer: Kyocera; Manufacturer: KYOCERA AVX; Temperature characteristics: X6S; Voltage: 10V; Tolerance: +/-20%; Sort order: 302; HasBeenBuilt: False; Alternative component: Allowed; System: RLC; Package: 0201; Operating temperature range: -55C to +105C; ClassName: SMALL; ComponentLink1Description: 1_Datasheet; ComponentLink2Description: 2_Product page; ComponentLink3Description: 3_X-information; ComponentLink4Description: 4_X-information; Creation date: 20190101; Source: RLC_UN1Q.SchLib; Manufacturer Part Number: KGM03CS61A105MH; Component Type: Capacitor
C240 = CMP-001-000280-15: CAP; Part Number: GRM0335C1H270JA01D; Manufacturer: TDK; Manufacturer: Murata; Temperature characteristics: C0G; Tolerance: +/-5%; Sort order: 302; HasBeenBuilt: TBD; Alternative component: Allowed; System: RLC; Package: 0201; ComponentLink1Description: 1_Datasheet; ComponentLink2Description: 2_Product page; ComponentLink3Description: 3_X-information; ComponentLink4Description: 4_X-information; Creation date: 20190101; ClassName: SMALL; Source: RLC_UN1Q.SchLib; Manufacturer Part Number: GRM0335C1H270JA01D; Component Type: Capacitor
C241 C242 = CMP-001-000887-10: CAP; Part Number: GRM155C81A225KE44D; Manufacturer: Murata; Temperature characteristics: X6S; Voltage: 10V; Tolerance: +/-10%; Sort order: 304; Alternative component: Allowed; System: RLC; Package: 0402; ComponentLink1Description: 1_Datasheet; ComponentLink2Description: 2_Product page; ComponentLink3Description: 3_X-information; ComponentLink4Description: 4_X-information; Creation date: 20190101; Manufacturer Part Number: GRM155C81A225KE44D; Component Type: Capacitor
C243-C246 = CMP-001-000889-11: as C83-C86 on sheet IMX8_PHY; Package: 0201; Dimensions WxLxH: 0.35; ComponentLink1Description: 1_Datasheet; ComponentLink2Description: 2_Product page; ComponentLink3Description: 3_X-information; ComponentLink4Description: 4_X-information; Creation date: 26042024; ClassName: SMALL; Manufacturer Part Number: GRM033C81A224KE01D; Component Type: Capacitor
D2-D4 = CMP-001-000916-4: as D1 on sheet USB_HUB; ComponentLink1Description: 1_Datasheet; ComponentLink1URL: http://www.ti.com/lit/gpn/tpd4e05u06; ComponentLink2Description: 2_Product page; ComponentLink2URL: https://www.ti.com/product/TPD4E05U06; ComponentLink3Description: 3_X-information; ComponentLink4Description: 4_X-information; Creation date: 20210927; Dimensions WxLxH: 2.5x1.0x0.55; Operating temperature range: -40... +125 °C; Package: USON10; Part Number: TPD4E05U06DQAR; ECCN: EAR99; RoHS: RoHS3; Source: UUDET_KOMPONENTIT.SchLib; Manufacturer Part Number: TPD4E05U06DQAR; Component Type: ESD & EMI
J9 = CMP-001-001438-8: as J7 on sheet USB_HUB; ClassName: BIG; ComponentLink1Description: 1_Datasheet; ComponentLink1URL: https://cdn.amphenol-cs.com/media/wysiwyg/files/documentation/datasheet/inputoutput/io_usb_type_c.pdf; ComponentLink2Description: 2_Product page; ComponentLink2URL: https://www.amphenol-cs.com/product/124018612112a.html; ComponentLink3Description: 3_X-information; ComponentLink4Description: 4_X-information; Operating temperature range: -40C to +85C; Creation date: 20250617; Manufacturer: Amphenol; ECCN: EAR99; Design Item ID: USB_C_AMPHENOL_124018612112A; RoHS: RoHS 3; Component Type: Interface Connector
J10-J14 = CMP-001-000153-12: Testpoint 1.0mm; Part Number: TP 1mm; Sort order: -; HasBeenBuilt: -; ClassName: SMALL; ComponentLink1Description: 1_Datasheet; ComponentLink2Description: 2_Product page; ComponentLink3Description: 3_X-information; ComponentLink4Description: 4_X-information; Creation date: 20200101; System: Test Point; Design Item ID: TP_1mm; Source: Conn_UN1Q.SchLib
  J11-J14: Component Type: Test Point
L26 L27 = CMP-001-000744-7: as L24 on sheet USB_HUB; Package: 0201; Operating temperature range: -55 ... +125C; ClassName: SMALL; ComponentLink1Description: 1_Datasheet; ComponentLink1URL: https://www.murata.com/en-us/products/productdetail.aspx?cate=luNoiseSupprFilteChipFerriBead&partno=BLM03PG330SN1%23; ComponentLink2Description: 2_Product page; ComponentLink3Description: 3_X-information; ComponentLink4Description: 4_X-information; Creation date: 20200304; Source: Discrete_UN1Q.SchLib; Manufacturer Part Number: BLM03PG330SN1; Component Type: Ferrite
PTP91 = CMP-001-001296-3: as PTP25#2 on sheet IMX8_PMIC; ComponentLink4Description: 4_X-information; ComponentLink1Description: 1_Datasheet; Sort order: -; ClassName: SMALL; System: Test Point; HasBeenBuilt: -; Design Item ID: PTP_0.4mm; ComponentLink3Description: 3_X-information; Creation date: 20240909; ComponentLink2Description: 2_Product page; Component Type: Test Point
R102 R103 = CMP-001-000738-12: as R100 on sheet USB_HUB; Package: 0402; Operating temperature range: -55 ... +125C; Dimensions WxLxH: 0.55mm; ComponentLink1Description: 1_Datasheet; ComponentLink1URL: https://www.murata.com/en-us/products/productdetail.aspx?cate=luNoiseSupprFilteChipFerriBead&partno=BLM15KD300SN1%23; ComponentLink2Description: 2_Product page; ComponentLink3Description: 3_X-information; ComponentLink4Description: 4_X-information; Creation date: 20200304; Source: Discrete_UN1Q.SchLib; ECCN: EAR99; RoHS: RoHS3; Component Type: Ferrite
R104 R105 = CMP-001-000526-11: as R45 on sheet IMX8_PMIC; Package: 0201; ClassName: SMALL; ComponentLink1Description: 1_Datasheet; ComponentLink2Description: 2_Product page; ComponentLink3Description: 3_X-information; ComponentLink4Description: 4_X-information; Creation date: 20190101; Source: RLC_UN1Q.SchLib; Component Type: Resistor
R106 = CMP-001-000434-10: as R41 on sheet IMX8_PMIC; Package: 0201; ClassName: SMALL; ComponentLink1Description: 1_Datasheet; ComponentLink2Description: 2_Product page; ComponentLink3Description: 3_X-information; ComponentLink4Description: 4_X-information; Creation date: 20190101; Source: RLC_UN1Q.SchLib; Component Type: Resistor
R107-R110 = CMP-001-000446-13: as R96-R99 on sheet USB_HUB; Package: 0201; ClassName: SMALL; ComponentLink1Description: 1_Datasheet; ComponentLink2Description: 2_Product page; ComponentLink3Description: 3_X-information; ComponentLink4Description: 4_X-information; Creation date: 20190101; Source: RLC_UN1Q.SchLib; Component Type: Resistor
T6 = CMP-001-000756-6: as T4 on sheet USB_HUB; Package: 0201; Operating temperature range: -40 ... +85C; Dimensions WxLxH: tbd; ComponentLink1Description: 1_Datasheet; ComponentLink1URL: https://www2.mouser.com/datasheet/2/40/AVX_GiGuard-1101674.pdf; ComponentLink2Description: 2_Product page; ComponentLink3Description: 3_X-information; ComponentLink4Description: 4_X-information; Creation date: 20211207; ClassName: SMALL; Source: Discrete_UN1Q.SchLib; Manufacturer Part Number: GG020105100N2P; Component Type: ESD & EMI
U12 = CMP-001-000798-6: ADJ. CURRENT-LIMITED POWER SWITCH, 2.5A; Manufacturer: Maxim Integrated; System: IC; HasBeenBuilt: SleeveIO_01; Sort order: 457; ClassName: BIG; Dimensions WxLxH: 2.05 mm x 2.05 mm x 0.8 mm; ComponentLink4Description: 4_X-information; Design Item ID: MAX14575C; Operating temperature range: -40 ... +85 °C; ComponentLink3Description: 3_X-information; Package: TDFN8; ComponentLink1URL: https://www.analog.com/media/en/technical-documentation/data-sheets/MAX14575A-MAX14575C.pdf; ComponentLink1Description: 1_Datasheet; ComponentLink2Description: 2_Product page; ComponentLink2URL: https://www.analog.com/en/products/max14575c.html; Creation date: 20211018; Source: IC_UN1Q.SchLib
U13 = CMP-001-001164-4: USB3.1 Gen1 Type-C Superspeed Active Signal Switch; Manufacturer: NXP; Manufacturer: Knowles; Manufacturer Part Number: 1825J0100820FCT; Sort order: 501; System: IC; Dimensions WxLxH: 2.4 x 2.0 x 0.35mm; Operating temperature range: -40C ... +85C; Part Number: PTN36043BBXY; ComponentLink3URL: https://www.nxp.com/design/design-center/development-boards-and-designs/analog-toolbox/ptn5150a-ptn36043-usb-type-c-cc-logic-evaluation-kit:OM13584; Package: DHX2QFN18; ComponentLink1URL: https://www.nxp.com/docs/en/data-sheet/PTN36043B.pdf; ComponentLink2Description: 2_Product page; Creation date: 20250417; ComponentLink3Description: 3_EVA kit; ComponentLink1Description: 1_Datasheet; ComponentLink4Description: 4_X-information; Component Type: Logic
U14 = CMP-076-000050-6: CC logic for USB Type-C applications; Manufacturer: NXP; Sort order: 501; System: IC; HasBeenBuilt: SALUKI_V2; Operating temperature range: -40C ... +85C; Design Item ID: PTN5150AHXMP; ComponentLink3Description: 3_X-information; ComponentLink1Description: 1_Datasheet; Package: X2QFN12; Source: IC_UN1Q.SchLib; ComponentLink4Description: 4_X-information; Dimensions WxLxH: 1.6x1.6x0.4mm; ComponentLink1URL: https://www.nxp.com/docs/en/data-sheet/PTN5150A.pdf; ComponentLink2Description: 2_Product page; ComponentLink2URL: https://www.nxp.com/part/PTN5150AHX#/; Creation date: 20220314; Part Number: PTN5150AHXMP